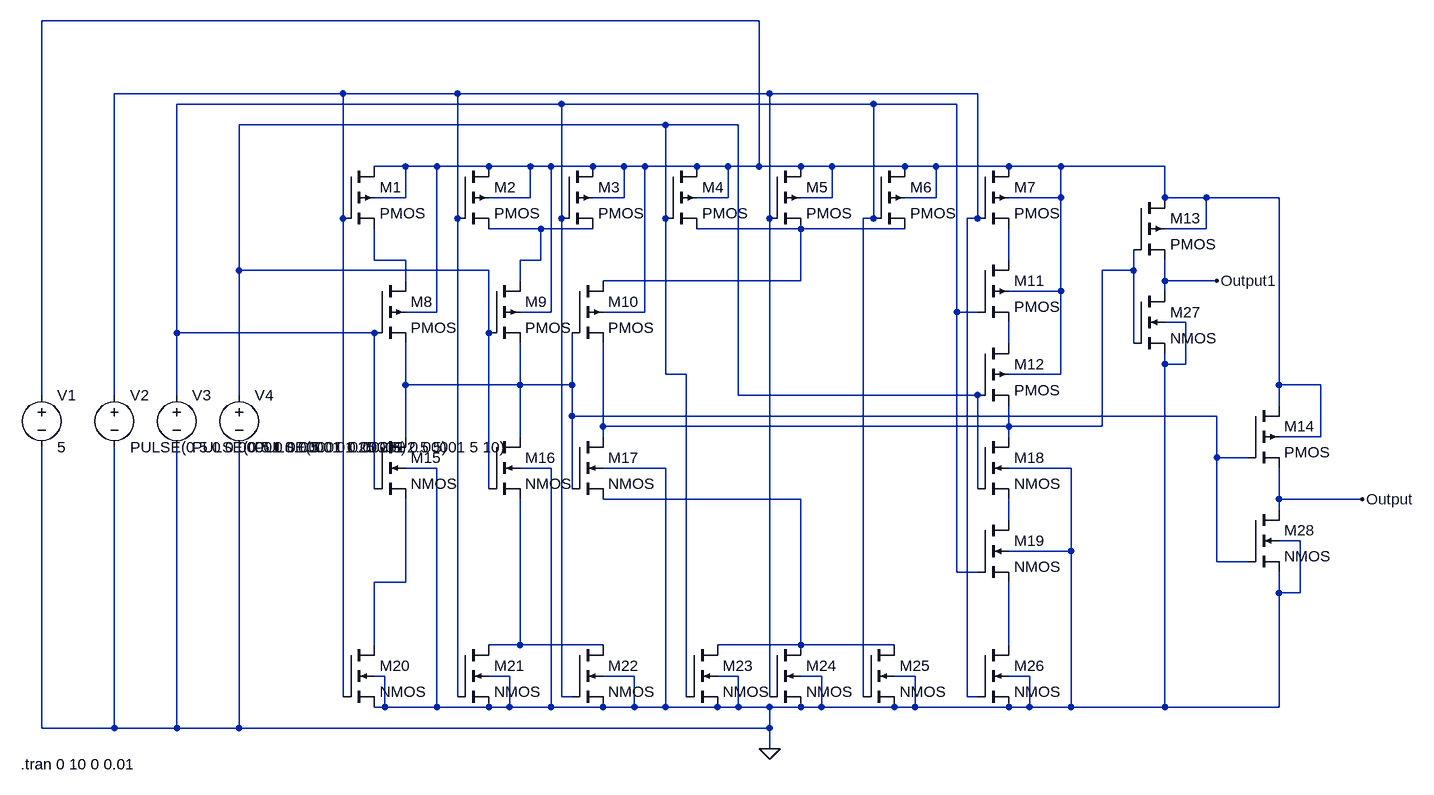
[diagram p0: schematic mirror_fa.asc]
mirror_fa.asc, the LTspice schematic file:
Version 4
SHEET 1 880 680
WIRE -272 -1664 -1376 -1664
WIRE -912 -1552 -1264 -1552
WIRE -736 -1552 -912 -1552
WIRE -256 -1552 -736 -1552
WIRE 64 -1552 -256 -1552
WIRE -576 -1536 -1168 -1536
WIRE -96 -1536 -576 -1536
WIRE 32 -1536 -96 -1536
WIRE -416 -1504 -1072 -1504
WIRE -304 -1504 -416 -1504
WIRE -816 -1440 -864 -1440
WIRE -768 -1440 -816 -1440
WIRE -688 -1440 -768 -1440
WIRE -624 -1440 -688 -1440
WIRE -592 -1440 -624 -1440
WIRE -528 -1440 -592 -1440
WIRE -480 -1440 -528 -1440
WIRE -448 -1440 -480 -1440
WIRE -368 -1440 -448 -1440
WIRE -320 -1440 -368 -1440
WIRE -272 -1440 -272 -1664
WIRE -272 -1440 -320 -1440
WIRE -208 -1440 -272 -1440
WIRE -160 -1440 -208 -1440
WIRE -48 -1440 -160 -1440
WIRE 0 -1440 -48 -1440
WIRE 112 -1440 0 -1440
WIRE 192 -1440 112 -1440
WIRE 352 -1440 192 -1440
WIRE -816 -1392 -816 -1440
WIRE -816 -1392 -864 -1392
WIRE -624 -1392 -624 -1440
WIRE -624 -1392 -688 -1392
WIRE -480 -1392 -480 -1440
WIRE -480 -1392 -528 -1392
WIRE -320 -1392 -320 -1440
WIRE -320 -1392 -368 -1392
WIRE -160 -1392 -160 -1440
WIRE -160 -1392 -208 -1392
WIRE 0 -1392 0 -1440
WIRE 0 -1392 -48 -1392
WIRE 192 -1392 192 -1440
WIRE 192 -1392 112 -1392
WIRE 352 -1392 352 -1440
WIRE 416 -1392 352 -1392
WIRE 528 -1392 416 -1392
WIRE -912 -1360 -912 -1552
WIRE -736 -1360 -736 -1552
WIRE -576 -1360 -576 -1536
WIRE -416 -1360 -416 -1504
WIRE -256 -1360 -256 -1552
WIRE -96 -1360 -96 -1536
WIRE -96 -1360 -112 -1360
WIRE 64 -1360 64 -1552
WIRE 64 -1360 48 -1360
WIRE -608 -1344 -688 -1344
WIRE -528 -1344 -608 -1344
WIRE -208 -1344 -368 -1344
WIRE -48 -1344 -208 -1344
WIRE 416 -1344 416 -1392
WIRE 416 -1344 352 -1344
WIRE -864 -1296 -864 -1344
WIRE -816 -1296 -864 -1296
WIRE -608 -1296 -608 -1344
WIRE -608 -1296 -640 -1296
WIRE 112 -1296 112 -1344
WIRE -1072 -1280 -1072 -1504
WIRE -688 -1280 -1072 -1280
WIRE 304 -1280 304 -1312
WIRE 304 -1280 256 -1280
WIRE -816 -1264 -816 -1296
WIRE -640 -1264 -640 -1296
WIRE -208 -1264 -208 -1344
WIRE -208 -1264 -512 -1264
WIRE 352 -1264 352 -1296
WIRE 432 -1264 352 -1264
WIRE 192 -1248 192 -1392
WIRE 192 -1248 112 -1248
WIRE 352 -1248 352 -1264
WIRE -768 -1216 -768 -1440
WIRE -768 -1216 -816 -1216
WIRE -592 -1216 -592 -1440
WIRE -592 -1216 -640 -1216
WIRE -448 -1216 -448 -1440
WIRE -448 -1216 -512 -1216
WIRE 32 -1216 32 -1536
WIRE 64 -1216 32 -1216
WIRE 384 -1200 352 -1200
WIRE -1168 -1184 -1168 -1536
WIRE -864 -1184 -1168 -1184
WIRE -688 -1184 -688 -1280
WIRE 112 -1168 112 -1200
WIRE 304 -1168 304 -1280
WIRE 352 -1136 352 -1152
WIRE 384 -1136 384 -1200
WIRE 384 -1136 352 -1136
WIRE -416 -1120 -416 -1360
WIRE -384 -1120 -416 -1120
WIRE 192 -1120 192 -1248
WIRE 192 -1120 112 -1120
WIRE -816 -1104 -816 -1168
WIRE -640 -1104 -640 -1168
WIRE -640 -1104 -816 -1104
WIRE -560 -1104 -560 -1184
WIRE -560 -1104 -640 -1104
WIRE 528 -1104 528 -1392
WIRE 592 -1104 528 -1104
WIRE -1376 -1088 -1376 -1664
WIRE -1264 -1088 -1264 -1552
WIRE -1168 -1088 -1168 -1184
WIRE -1072 -1088 -1072 -1280
WIRE -304 -1088 -304 -1504
WIRE 64 -1088 -304 -1088
WIRE 528 -1072 528 -1104
WIRE -560 -1056 -560 -1104
WIRE 432 -1056 -560 -1056
WIRE -512 -1040 -512 -1168
WIRE 112 -1040 112 -1072
WIRE 112 -1040 -512 -1040
WIRE 256 -1040 256 -1280
WIRE 256 -1040 112 -1040
WIRE -816 -1024 -816 -1104
WIRE -640 -1024 -640 -1104
WIRE -512 -1024 -512 -1040
WIRE 112 -1024 112 -1040
WIRE 592 -1024 592 -1104
WIRE 592 -1024 528 -1024
WIRE 432 -992 432 -1056
WIRE 480 -992 432 -992
WIRE -768 -976 -816 -976
WIRE -592 -976 -640 -976
WIRE -416 -976 -512 -976
WIRE 208 -976 112 -976
WIRE -864 -944 -864 -1184
WIRE -688 -944 -688 -1184
WIRE -560 -944 -560 -1056
WIRE 64 -944 64 -1088
WIRE -208 -928 -512 -928
WIRE 528 -928 528 -976
WIRE 656 -928 528 -928
WIRE 528 -912 528 -928
WIRE 112 -896 112 -928
WIRE 560 -864 528 -864
WIRE 208 -848 208 -976
WIRE 208 -848 112 -848
WIRE 432 -832 432 -992
WIRE 480 -832 432 -832
WIRE 32 -816 32 -1216
WIRE 64 -816 32 -816
WIRE -816 -800 -816 -928
WIRE -816 -800 -864 -800
WIRE 528 -784 528 -816
WIRE 560 -784 560 -864
WIRE 560 -784 528 -784
WIRE -864 -704 -864 -800
WIRE -640 -704 -640 -928
WIRE -640 -704 -688 -704
WIRE -512 -704 -640 -704
WIRE -208 -704 -208 -928
WIRE -208 -704 -336 -704
WIRE -64 -704 -208 -704
WIRE 112 -704 112 -800
WIRE -848 -656 -864 -656
WIRE -656 -656 -688 -656
WIRE -464 -656 -512 -656
WIRE -304 -656 -336 -656
WIRE -176 -656 -208 -656
WIRE -32 -656 -64 -656
WIRE 144 -656 112 -656
WIRE -912 -624 -912 -1360
WIRE -736 -624 -736 -1360
WIRE -576 -624 -576 -1360
WIRE -560 -624 -576 -624
WIRE -384 -624 -384 -1120
WIRE -256 -624 -256 -1360
WIRE -112 -624 -112 -1360
WIRE 48 -624 48 -1360
WIRE 64 -624 48 -624
WIRE -848 -608 -848 -656
WIRE -848 -608 -864 -608
WIRE -768 -608 -768 -976
WIRE -768 -608 -848 -608
WIRE -688 -608 -768 -608
WIRE -656 -608 -656 -656
WIRE -656 -608 -688 -608
WIRE -592 -608 -592 -976
WIRE -592 -608 -656 -608
WIRE -512 -608 -592 -608
WIRE -464 -608 -464 -656
WIRE -464 -608 -512 -608
WIRE -416 -608 -416 -976
WIRE -416 -608 -464 -608
WIRE -336 -608 -416 -608
WIRE -304 -608 -304 -656
WIRE -304 -608 -336 -608
WIRE -256 -608 -304 -608
WIRE -208 -608 -256 -608
WIRE -176 -608 -176 -656
WIRE -176 -608 -208 -608
WIRE -64 -608 -176 -608
WIRE -32 -608 -32 -656
WIRE -32 -608 -64 -608
WIRE 112 -608 -32 -608
WIRE 144 -608 144 -656
WIRE 144 -608 112 -608
WIRE 208 -608 208 -848
WIRE 208 -608 144 -608
WIRE 352 -608 352 -1136
WIRE 352 -608 208 -608
WIRE 528 -608 528 -784
WIRE 528 -608 352 -608
WIRE -1376 -576 -1376 -1008
WIRE -1264 -576 -1264 -1008
WIRE -1264 -576 -1376 -576
WIRE -1168 -576 -1168 -1008
WIRE -1168 -576 -1264 -576
WIRE -1072 -576 -1072 -1008
WIRE -1072 -576 -1168 -576
WIRE -256 -576 -256 -608
WIRE -256 -576 -1072 -576
WIRE -256 -544 -256 -576
FLAG -256 -544 0
FLAG 656 -928 Output
FLAG 432 -1264 Output1
SYMBOL pmos4 -912 -1440 R0
SYMATTR InstName M1
SYMBOL pmos4 -736 -1440 R0
SYMATTR InstName M2
SYMATTR Value2 l=0.000006 w=0.00000018
SYMBOL pmos4 -576 -1440 R0
SYMATTR InstName M3
SYMATTR Value2 l=0.000006 w=0.00000018
SYMBOL pmos4 -416 -1440 R0
SYMATTR InstName M4
SYMATTR Value2 l=0.000006 w=0.00000018
SYMBOL pmos4 -256 -1440 R0
SYMATTR InstName M5
SYMATTR Value2 l=0.000006 w=0.00000018
SYMBOL pmos4 -96 -1440 R0
SYMATTR InstName M6
SYMATTR Value2 l=0.000006 w=0.00000018
SYMBOL pmos4 64 -1440 R0
SYMATTR InstName M7
SYMATTR Value2 l=0.000006 w=0.00000018
SYMBOL pmos4 -864 -1264 R0
SYMATTR InstName M8
SYMATTR Value2 l=0.000006 w=0.00000018
SYMBOL pmos4 -688 -1264 R0
SYMATTR InstName M9
SYMATTR Value2 l=0.000006 w=0.00000018
SYMBOL pmos4 -560 -1264 R0
SYMATTR InstName M10
SYMATTR Value2 l=0.000006 w=0.00000018
SYMBOL pmos4 64 -1296 R0
SYMATTR InstName M11
SYMATTR Value2 l=0.000006 w=0.00000018
SYMBOL pmos4 64 -1168 R0
SYMATTR InstName M12
SYMATTR Value2 l=0.000006 w=0.00000018
SYMBOL pmos4 304 -1392 R0
SYMATTR InstName M13
SYMATTR Value2 l=0.000006 w=0.00000018
SYMBOL pmos4 480 -1072 R0
SYMATTR InstName M14
SYMATTR Value2 l=0.000006 w=0.00000018
SYMBOL nmos4 -864 -1024 R0
SYMATTR InstName M15
SYMATTR Value2 l=2u w=0.18u
SYMBOL nmos4 -688 -1024 R0
SYMATTR InstName M16
SYMATTR Value2 l=2u w=0.18u
SYMBOL nmos4 -560 -1024 R0
SYMATTR InstName M17
SYMATTR Value2 l=2u w=0.18u
SYMBOL nmos4 64 -1024 R0
SYMATTR InstName M18
SYMATTR Value2 l=2u w=0.18u
SYMBOL nmos4 64 -896 R0
SYMATTR InstName M19
SYMATTR Value2 l=2u w=0.18u
SYMBOL nmos4 -912 -704 R0
SYMATTR InstName M20
SYMATTR Value2 l=2u w=0.18u
SYMBOL nmos4 -736 -704 R0
SYMATTR InstName M21
SYMATTR Value2 l=2u w=0.18u
SYMBOL nmos4 -560 -704 R0
SYMATTR InstName M22
SYMATTR Value2 l=2u w=0.18u
SYMBOL nmos4 -384 -704 R0
SYMATTR InstName M23
SYMBOL nmos4 -256 -704 R0
SYMATTR InstName M24
SYMATTR Value2 l=2u w=0.18u
SYMBOL nmos4 -112 -704 R0
SYMATTR InstName M25
SYMATTR Value2 l=2u w=0.18u
SYMBOL nmos4 64 -704 R0
SYMATTR InstName M26
SYMBOL nmos4 304 -1248 R0
SYMATTR InstName M27
SYMBOL nmos4 480 -912 R0
SYMATTR InstName M28
SYMATTR Value2 l=2u w=0.18u
SYMBOL voltage -1376 -1104 R0
WINDOW 123 0 0 Left 0
WINDOW 39 0 0 Left 0
SYMATTR InstName V1
SYMATTR Value 5
SYMBOL voltage -1264 -1104 R0
WINDOW 123 0 0 Left 0
WINDOW 39 0 0 Left 0
SYMATTR InstName V2
SYMATTR Value PULSE(0 5 0 0.00001 0.00001 1.25 2.5)
SYMBOL voltage -1168 -1104 R0
WINDOW 123 0 0 Left 0
WINDOW 39 0 0 Left 0
SYMATTR InstName V3
SYMATTR Value PULSE(0 5 0 0.00001 0.00001 2.5 5)
SYMBOL voltage -1072 -1104 R0
WINDOW 123 0 0 Left 0
WINDOW 39 0 0 Left 0
SYMATTR InstName V4
SYMATTR Value PULSE(5 0 0 0.00001 0.00001 5 10)
TEXT -1408 -520 Left 2 !.tran 0 10 0 0.01

The netlist it stands for:
* mirror_fa.asc
M1 N001 N002 N007 N001 PMOS
M2 N001 N002 N005 N001 PMOS l=0.000006 w=0.00000018
M3 N001 N003 N005 N001 PMOS l=0.000006 w=0.00000018
M4 N001 N004 N006 N001 PMOS l=0.000006 w=0.00000018
M5 N001 N002 N006 N001 PMOS l=0.000006 w=0.00000018
M6 N001 N003 N006 N001 PMOS l=0.000006 w=0.00000018
M7 N001 N002 N008 N001 PMOS l=0.000006 w=0.00000018
M8 N007 N003 N011 N001 PMOS l=0.000006 w=0.00000018
M9 N005 N004 N011 N001 PMOS l=0.000006 w=0.00000018
M10 N006 N011 N009 N001 PMOS l=0.000006 w=0.00000018
M11 N008 N003 N010 N001 PMOS l=0.000006 w=0.00000018
M12 N010 N004 N009 N001 PMOS l=0.000006 w=0.00000018
M13 N001 N009 Output1 N001 PMOS l=0.000006 w=0.00000018
M14 N001 N011 Output N001 PMOS l=0.000006 w=0.00000018
M15 N011 N003 N014 0 NMOS l=2u w=0.18u
M16 N011 N004 N015 0 NMOS l=2u w=0.18u
M17 N009 N011 N012 0 NMOS l=2u w=0.18u
M18 N009 N004 N013 0 NMOS l=2u w=0.18u
M19 N013 N003 N016 0 NMOS l=2u w=0.18u
M20 N014 N002 0 0 NMOS l=2u w=0.18u
M21 N015 N002 0 0 NMOS l=2u w=0.18u
M22 N015 N003 0 0 NMOS l=2u w=0.18u
M23 N012 N004 0 0 NMOS
M24 N012 N002 0 0 NMOS l=2u w=0.18u
M25 N012 N003 0 0 NMOS l=2u w=0.18u
M26 N016 N002 0 0 NMOS
M27 Output1 N009 0 0 NMOS
M28 Output N011 0 0 NMOS l=2u w=0.18u
V1 N001 0 5
V2 N002 0 PULSE(0 5 0 0.00001 0.00001 1.25 2.5)
V3 N003 0 PULSE(0 5 0 0.00001 0.00001 2.5 5)
V4 N004 0 PULSE(5 0 0 0.00001 0.00001 5 10)
.model NMOS NMOS
.model PMOS PMOS
.lib standard.mos
.tran 0 10 0 0.01
.backanno
.end

* Results of the author's LTspice run, read from the files saved beside the schematic
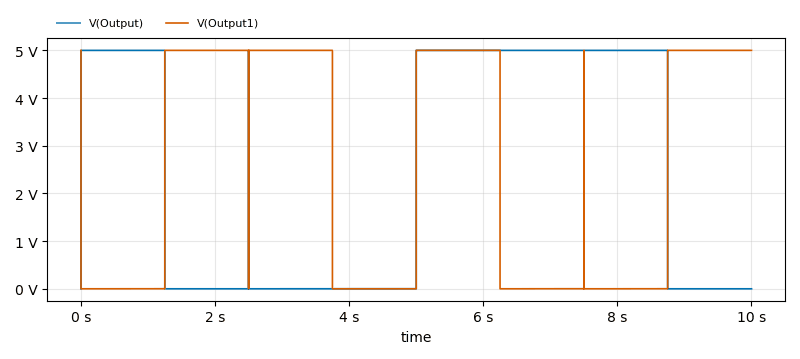
[diagram p1: Transient Analysis of mirror_fa.asc, plotted from the saved traces]
* Transient Analysis, 1 run:
*   V(Output): min 1.112 µV, max 5 V, average 2.5 V, rms 3.536 V, last 1.112 µV
*   V(Output1): min 0 V, max 5 V, average 2.5 V, rms 3.536 V, last 5 V